# Altium schematic sheet DC Motor Speed.SchDoc
size A; SheetNumber: 5; SheetTotal: 15
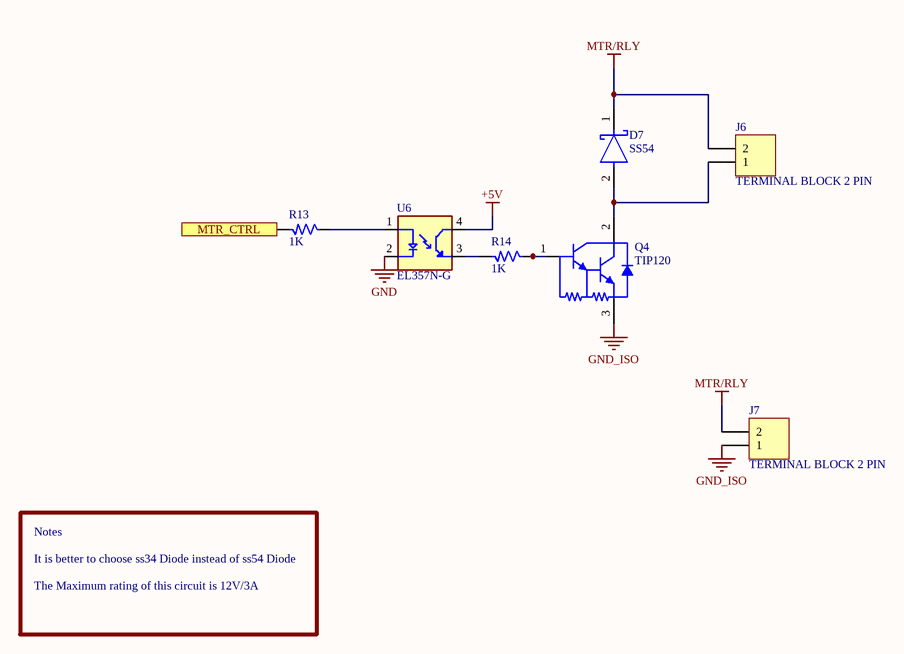
[diagram p0: DC Motor Speed.SchDoc]

## Parts
D7  SS54  [FP-95400-MFG]
J6  TERMINAL BLOCK 2 PIN  [CON2_P196_1729128_TH_ST]
J7  TERMINAL BLOCK 2 PIN  [CON2_P196_1729128_TH_ST]
Q4  TIP120  [ONSC-TO-220-3-221A-09]
R13  1K  [RES_0805]
R14  1K  [RES_0805]
U6  EL357N-G  [OPTO_EL357N-G]

## Ports
MTR_CTRL (in, see Block Diagram[7B])

## Nets
+5V: U6.4(CT)
GND: U6.2(C)
GND_ISO: J7.1 Q4.3(E)
MTR/RLY: D7.1(C) J6.2 J7.2
MTR_CTRL: R13.2 ; port MTR_CTRL
NetD7_2: D7.2(A) J6.1 Q4.2(C)
NetQ4_1: Q4.1(B) R14.1
NetR13_1: R13.1 U6.1(A)
NetR14_2: R14.2 U6.3(ET)

## Notes on the sheet
- Notes
- It is better to choose ss34 Diode instead of ss54 Diode
- The Maximum rating of this circuit is 12V/3A

## Library data of the parts
D7 = SS54-Schottky-40V-3A-DO214AC: DIODE SCHOTTKY 40V 5A DO214AC; Element Configuration: Single; Max Reverse Leakage Current: 200uA; Polarity: Standard; Peak Non-Repetitive Surge Current: 100A; Max Reverse Current: 0.1mA; Forward Voltage: 550mV; Max Forward Surge Current (Ifsm): 75A; Radiation Hardening: No; Current Rating: 5A; Contact Plating: Tin; Output Current: 5A; Height: 2.087mm; Mount: Surface Mount; Case/Package: SMA; Packaging: Tape and Reel; Width: 2.79mm; Average Rectified Current: 5A; Max Repetitive Reverse Voltage (Vrrm): 40V; Max Operating Temperature: 150°C; Length: 4.5mm; RoHS Compliant: Yes; Voltage Rating (DC): 40V; Min Operating Temperature: -65°C; Max Reverse Voltage (DC): 40V; Number of Pins: 2; Lead Free: Lead Free; Forward Current: 5A; Max Surge Current: 100A; Package Quantity: 1
J6 J7 = CON-TB_2X1-196-ST-TH: 2 Pins, 1 Row 5mm Pitch, straight Connector, male; Manufacturer: Phoenix Contact; Manufacturer Part Number: MKDSN1,5/2; Alternate Part Number-1: NA; Case/Package: TH-CON; Supplier-1: SP ROAD; Supplier Part Number-1: MKDSN1,5/2
Q4 = TIP120: Plastic Medium-Power, Complementary Silicon Transistor, 3-Pin TO-220, Tube; Manufacturer: On Semiconductor; IC Continuous (A): 5; Polarity: NPN; ComponentLink2URL: http://www.onsemi.cn/pub_link/Collateral/TIP120-D.PDF; Packing: Tube; PartNumber: TIP120; ComponentLink3Description: Package Specification; PackageDescription: 3-Pin Flange Mount, Vertical Straight Lead, Body 9.97 x 4.445 mm, Pitch 2.54 mm; Mounting Technology: Through Hole; ComponentLink1URL: http://www.onsemi.com/; PackageVersion: Rev. AG, 09/2011; ComponentLink1Description: Manufacturer URL; PackageReference: TO-220-3-221A-09; ComponentLink2Description: Datasheet; RoHS: FALSE; DatasheetVersion: Rev. 8; ComponentLink3URL: http://www.onsemi.com/pub_link/Collateral/221A-09.PDF
R13 R14 = RES_1K-0.125W-1%-0805: 1 kOhms ±1% 0.125W, 1/8W Chip Resistor 0805 (2012 Metric) Moisture Resistant Thick Film; Manufacturer: Walsin; Manufacturer Part Number: WR08X1001FTL; Case/Package: 0805; Supplier-1: SP ROAD; Supplier Part Number-1: RC0805JR-071KL; Alternate Part Number-1: WR08X1001FTL
U6 = EL357N-G: PHOTOTRANSISTOR PHOTOCOUPLER; Package: None; Price: None; Availability: Unavailable; MP: EL357N-G; Value: *